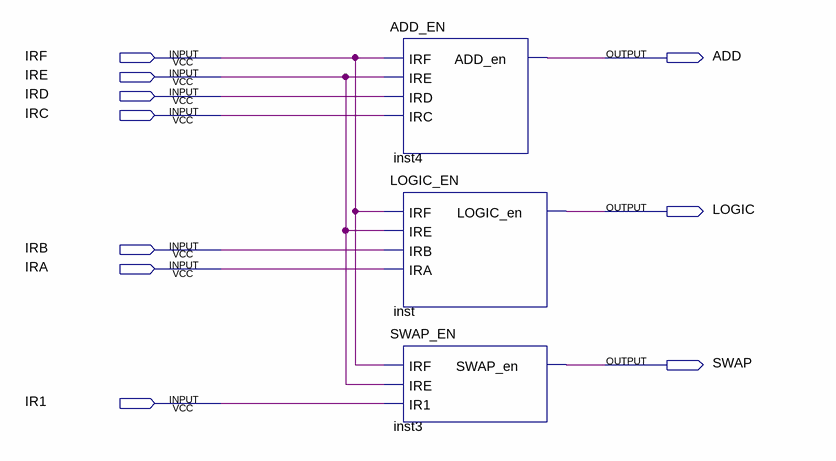
[diagram p0: schematic sheet]
// Quartus schematic IR_encoder.bdf as structural Verilog: 3 symbols, 10 pins
module IR_encoder (
  input  IRF,
  input  IRE,
  input  IRD,
  input  IRC,
  input  IRB,
  input  IRA,
  input  IR1,
  output ADD,
  output LOGIC,
  output SWAP
);

  ADD_EN inst4 (.IRF(IRF), .IRE(IRE), .IRD(IRD), .IRC(IRC), .ADD_en(ADD));
  LOGIC_EN inst (.IRF(IRF), .IRE(IRE), .IRB(IRB), .IRA(IRA), .LOGIC_en(LOGIC));
  SWAP_EN inst3 (.IRF(IRF), .IRE(IRE), .IR1(IR1), .SWAP_en(SWAP));
endmodule
